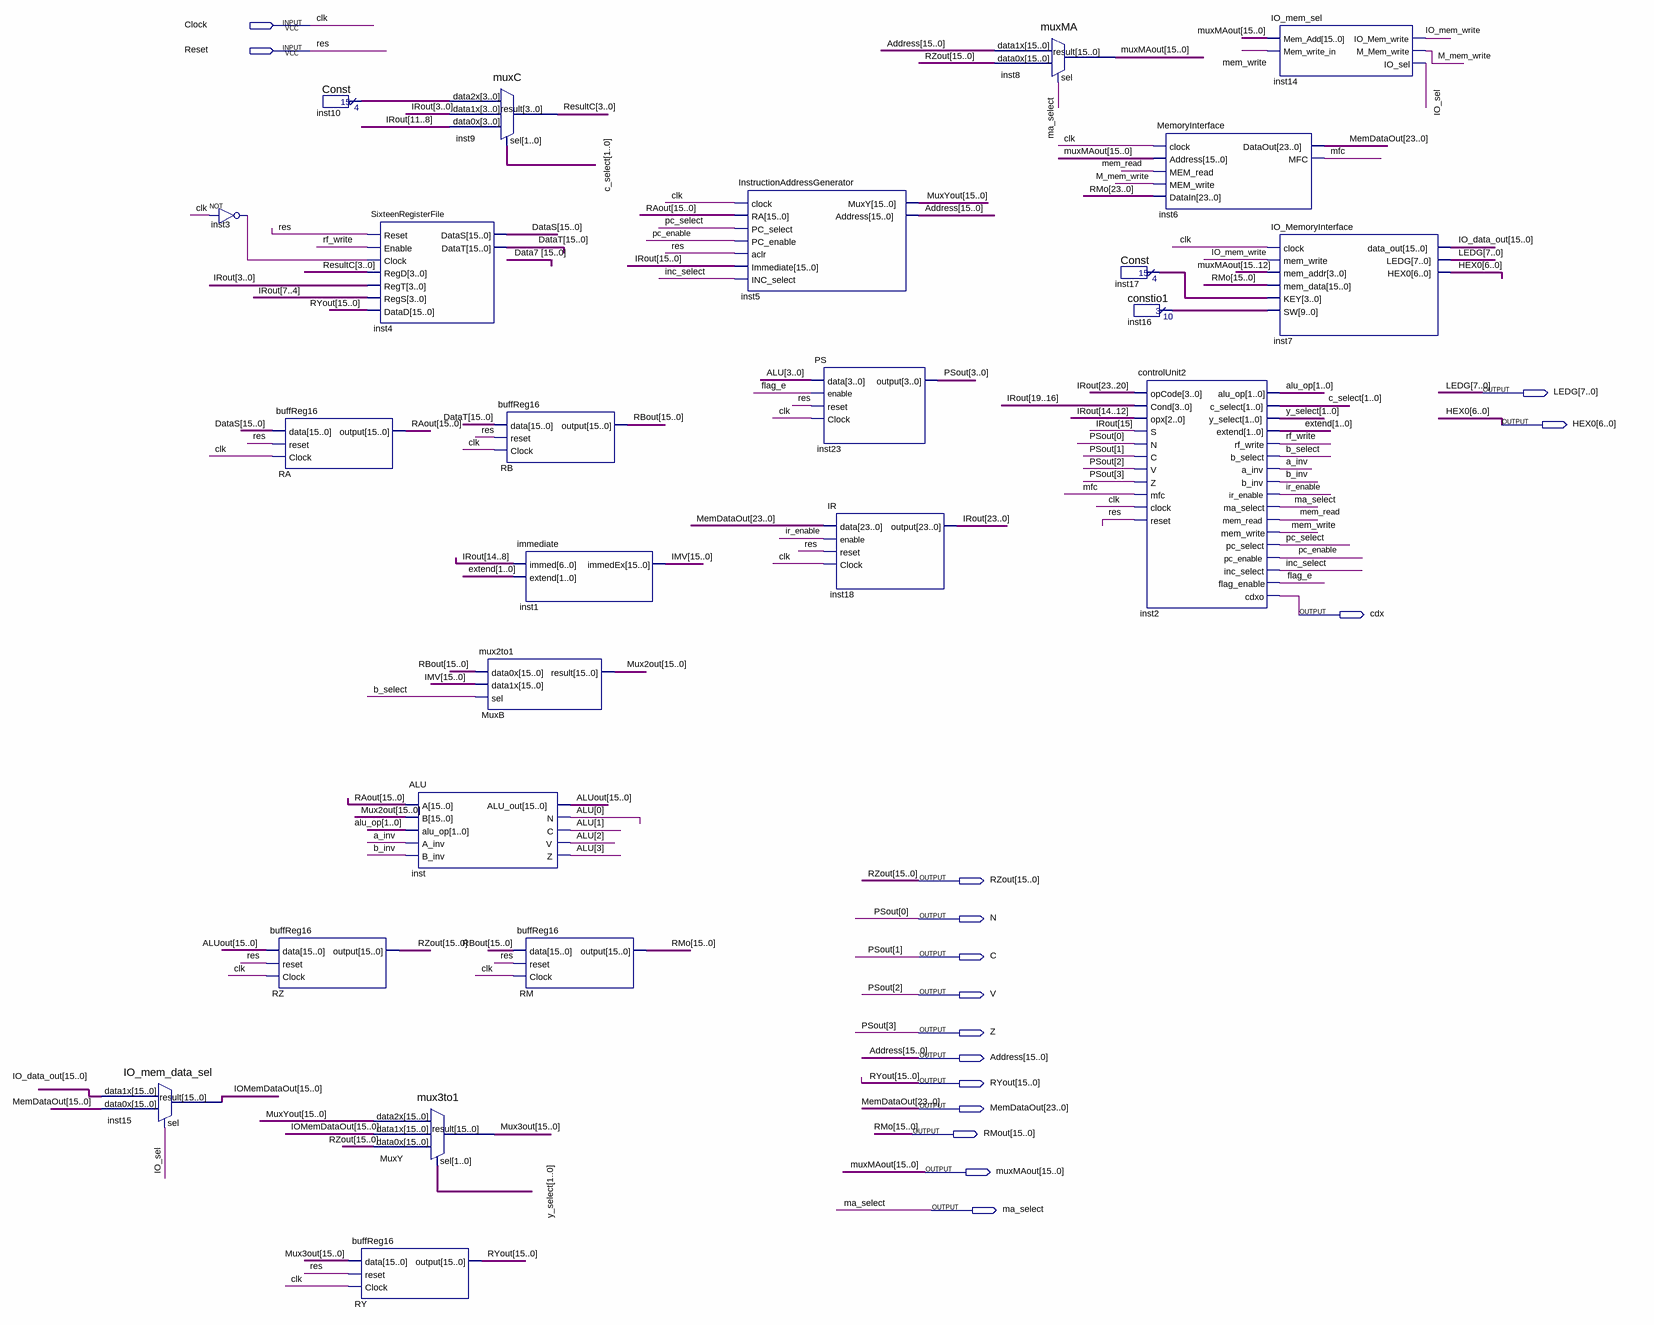
[diagram p0: schematic sheet]
// Quartus schematic Part3.bdf as structural Verilog: 24 symbols, 16 pins
module Part3 (
  input  Clock,
  input  Reset,
  output [7:0] LEDG,
  output [6:0] HEX0,
  output cdx,
  output [15:0] RZout,
  output N,
  output C,
  output V,
  output Z,
  output [15:0] Address,
  output [15:0] RYout,
  output [23:0] MemDataOut,
  output [15:0] RMout,
  output [15:0] muxMAout,
  output ma_select
);

  wire a_inv, b_inv, b_select, flag_e, inc_select, inst3_out, IO_mem_write, IO_sel, ir_enable, M_mem_write,
       mem_read, mem_write, mfc, pc_enable, pc_select, rf_write;
  wire [1:0] alu_op, c_select, extend, y_select;
  wire [3:0] ALU, inst10_result, inst17_result, ResultC;
  wire [9:0] inst16_result;
  wire [15:0] ALUout, DataS, DataT, IMV, IO_data_out, IOMemDataOut, Mux2out, Mux3out, MuxYout, RAout, RBout;
  wire [23:0] IRout;
  wire [23:16] RMo;

  IO_mem_data_sel inst15 (.data1x(IO_data_out), .data0x(MemDataOut[15:0]), .sel(IO_sel), .result(IOMemDataOut));
  not inst3 (inst3_out, Clock);
  buffReg16 RA (.data(DataS), .reset(Reset), .Clock(Clock), .\output (RAout));
  buffReg16 RZ (.data(ALUout), .reset(Reset), .Clock(Clock), .\output (RZout));
  Const inst10 (.result(inst10_result));
  SixteenRegisterFile inst4 (
    .Reset(Reset), .Enable(rf_write), .Clock(inst3_out), .RegD(ResultC), .RegT(IRout[3:0]),
    .RegS(IRout[7:4]), .DataD(RYout), .DataS(DataS), .DataT(DataT));
  mux3to1 MuxY (.data2x(MuxYout), .data1x(IOMemDataOut), .data0x(RZout), .sel(y_select), .result(Mux3out));
  buffReg16 RY (.data(Mux3out), .reset(Reset), .Clock(Clock), .\output (RYout));
  ALU inst (
    .A(RAout), .B(Mux2out), .alu_op(alu_op), .A_inv(a_inv), .B_inv(b_inv), .ALU_out(ALUout), .N(ALU[0]),
    .C(ALU[1]), .V(ALU[2]), .Z(ALU[3]));
  muxC inst9 (.data2x(inst10_result), .data1x(IRout[3:0]), .data0x(IRout[11:8]), .sel(c_select), .result(ResultC));
  mux2to1 MuxB (.data0x(RBout), .data1x(IMV), .sel(b_select), .result(Mux2out));
  buffReg16 RB (.data(DataT), .reset(Reset), .Clock(Clock), .\output (RBout));
  immediate inst1 (.immed(IRout[14:8]), .extend(extend), .immedEx(IMV));
  buffReg16 RM (.data(RBout), .reset(Reset), .Clock(Clock), .\output (RMout));
  InstructionAddressGenerator inst5 (
    .clock(Clock), .RA(RAout), .PC_select(pc_select), .PC_enable(pc_enable), .aclr(Reset),
    .Immediate(IRout[15:0]), .INC_select(inc_select), .MuxY(MuxYout), .Address(Address));
  PS inst23 (.data(ALU), .enable(flag_e), .reset(Reset), .Clock(Clock), .\output ({Z, V, C, N}));
  IR inst18 (.data(MemDataOut), .enable(ir_enable), .reset(Reset), .Clock(Clock), .\output (IRout));
  muxMA inst8 (.data1x(Address), .data0x(RZout), .sel(ma_select), .result(muxMAout));
  Const inst17 (.result(inst17_result));
  constio1 inst16 (.result(inst16_result));
  controlUnit2 inst2 (
    .opCode(IRout[23:20]), .Cond(IRout[19:16]), .opx(IRout[14:12]), .S(IRout[15]), .N(N), .C(C), .V(V),
    .Z(Z), .mfc(mfc), .clock(Clock), .reset(Reset), .alu_op(alu_op), .c_select(c_select),
    .y_select(y_select), .extend(extend), .rf_write(rf_write), .b_select(b_select), .a_inv(a_inv),
    .b_inv(b_inv), .ir_enable(ir_enable), .ma_select(ma_select), .mem_read(mem_read), .mem_write(mem_write),
    .pc_select(pc_select), .pc_enable(pc_enable), .inc_select(inc_select), .flag_enable(flag_e), .cdxo(cdx));
  MemoryInterface inst6 (
    .clock(Clock), .Address(muxMAout), .MEM_read(mem_read), .MEM_write(M_mem_write), .DataIn({RMo, RMout}),
    .DataOut(MemDataOut), .MFC(mfc));
  IO_mem_sel inst14 (
    .Mem_Add(muxMAout), .Mem_write_in(mem_write), .IO_Mem_write(IO_mem_write), .M_Mem_write(M_mem_write),
    .IO_sel(IO_sel));
  IO_MemoryInterface inst7 (
    .clock(Clock), .mem_write(IO_mem_write), .mem_addr(muxMAout[15:12]), .mem_data(RMout),
    .KEY(inst17_result), .SW(inst16_result), .data_out(IO_data_out), .LEDG(LEDG), .HEX0(HEX0));

  // Other names for the same wires on the sheet: clk = Clock; PSout[3:0] = {Z, V, C, N}; res = Reset;
  //   RMo[15:0] = RMout
endmodule
